# EAGLE schematic Eagle_LED (EAGLE 6.6.0)
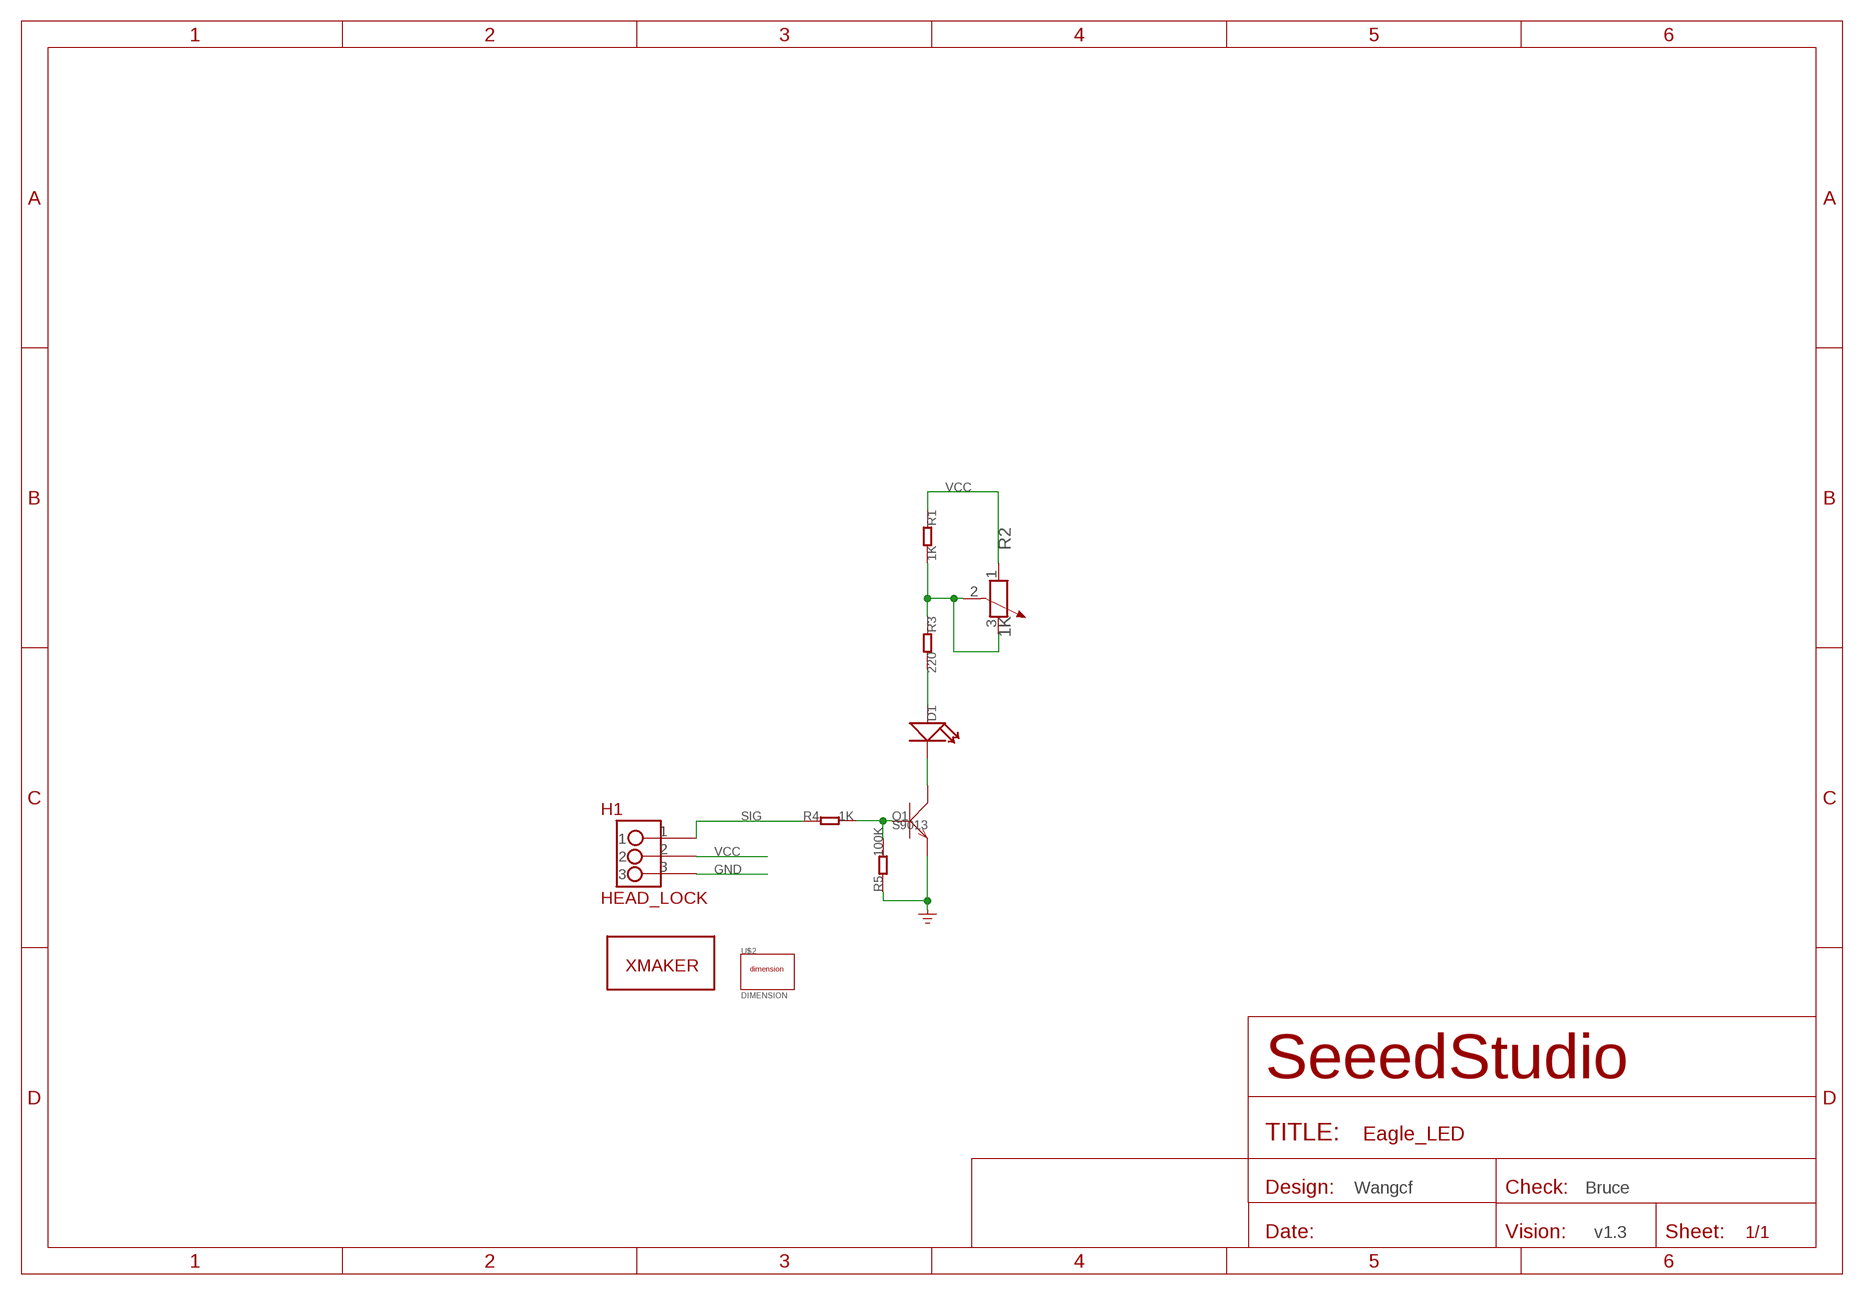
[diagram p0: schematic, sheet 1]

## Parts
D1  LED-6MM  [LED-2P-2.54-6MM]
H1  HEAD_LOCK  [HEAD_LOCK]
Q1  S9013  TRANSISTOR-NPN-SOT23  [SOT23]
R1  1K  005-R0603  [0603]
R2  1K  R-POTENTIOMETER'EVN-D8A-A03-B**'  [3P-SQUA-6.7X6.4]
R3  220  005-R0603  [0603]
R4  1K  005-R0603  [0603]
R5  100K  005-R0603  [0603]
U$2  DIMENSION  [DIMENSION]
U$4  XMAKERLOGO  [XMAKERLOGO]

## Nets
GND: H1.3 Q1.2(E) R5.1
N$1: R1.2 R2.2 R2.3 R3.1
N$2: D1.- Q1.3(C)
N$3: D1.+ R3.2
N$4: Q1.1(B) R4.2 R5.2
SIG: H1.1 R4.1
VCC: H1.2 R1.1 R2.1

## Notes on the sheet
- Wangcf | Bruce
- v1.3

## Library data of the parts
D1 = Discrete:LED*
H1 = HEAD_LOCK:HEAD_LOCK: 带锁的排座
Q1 = Discrete:TRANSISTOR-NPN*: NPN audion
R1 R3-R5 = Discrete:005-R*
R2 = Discrete:R-POTENTIOMETER*: Potentiometer
U$2 = Xmaker_yuhui:DIMENSION
U$4 = switch-tact:XMAKERLOGO